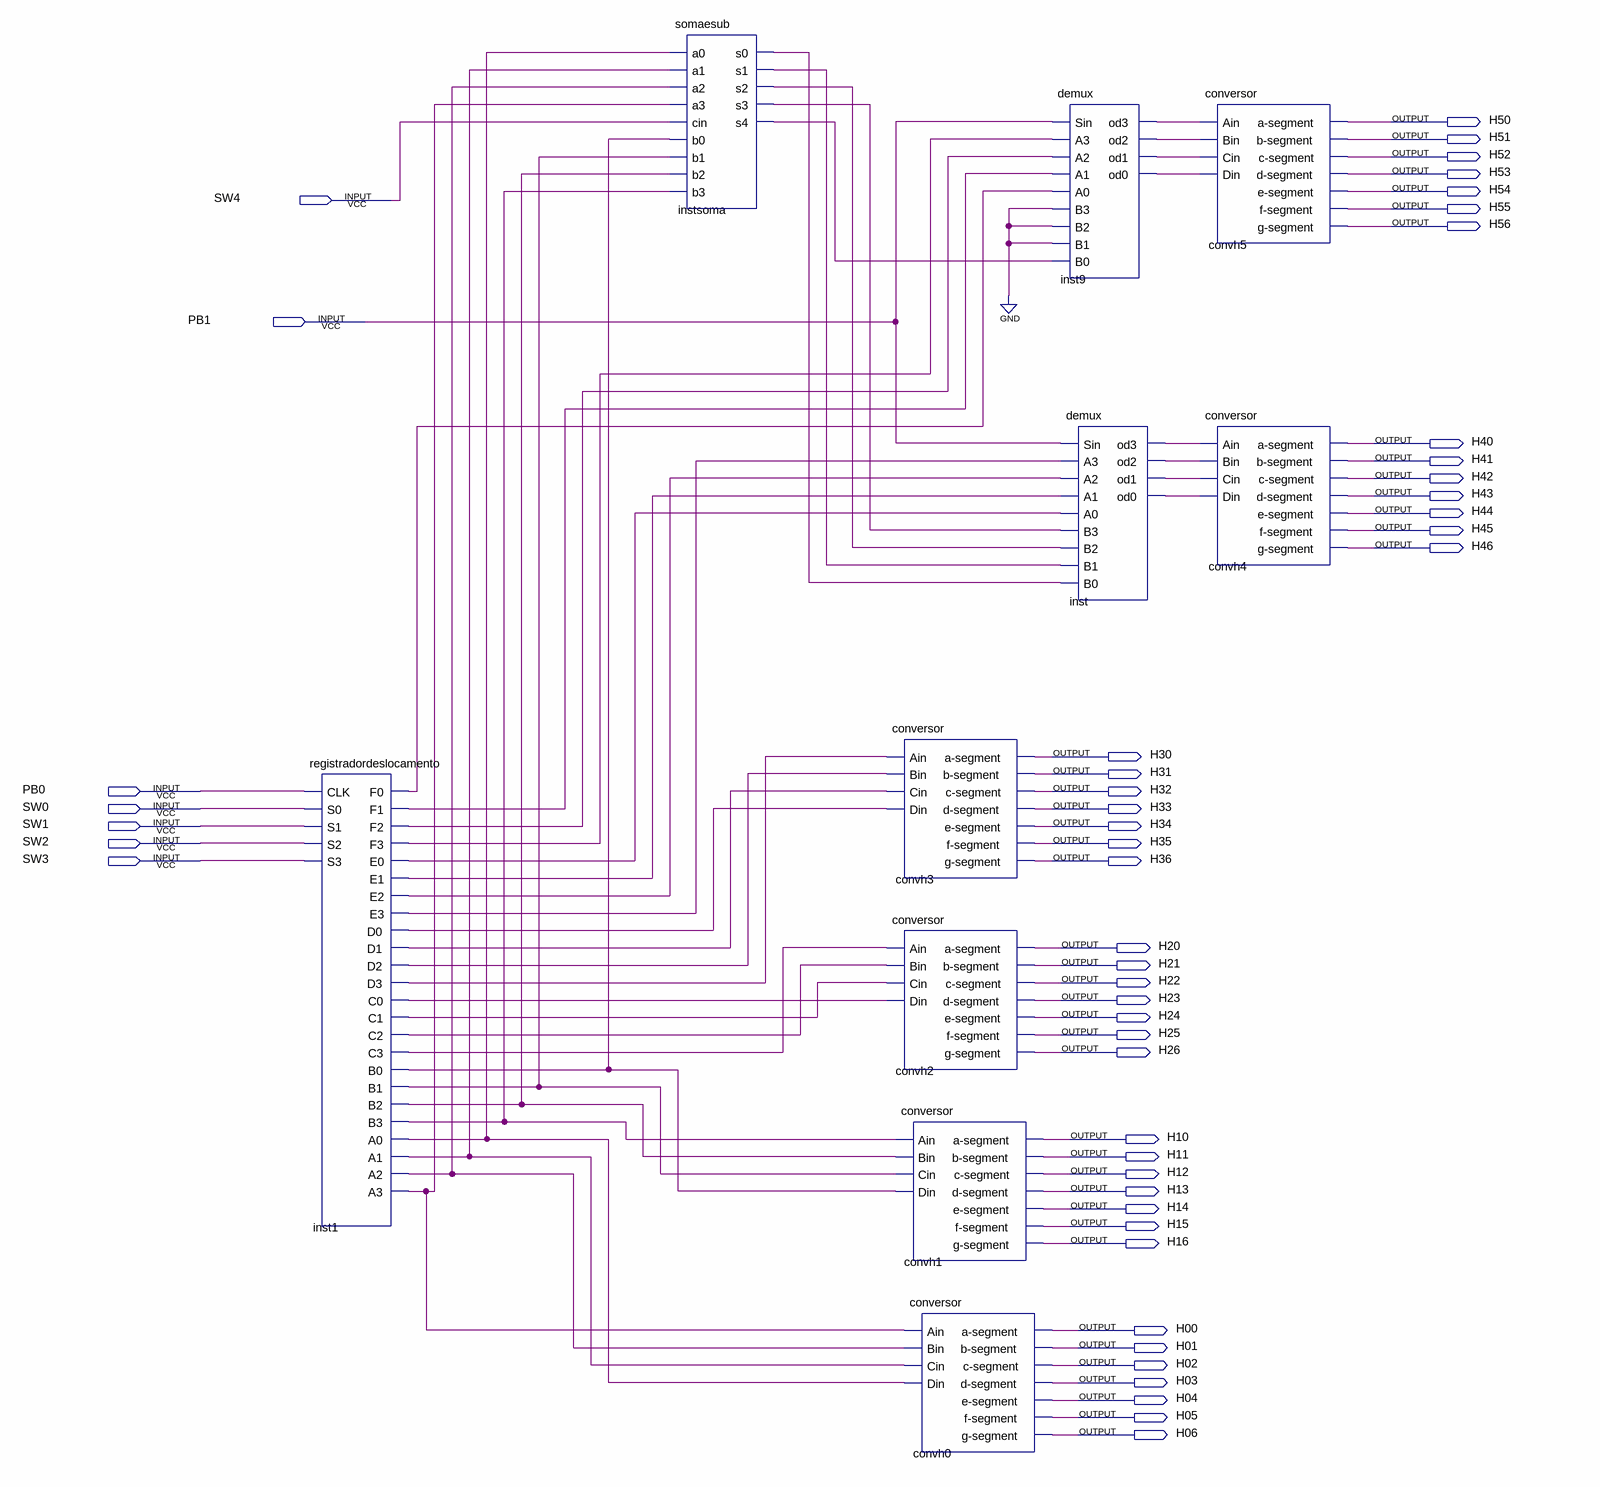
[diagram p0: schematic sheet]
// Quartus schematic contadorasync.bdf as structural Verilog: 10 symbols, 49 pins
module contadorasync (
  input  SW4,
  input  PB1,
  input  PB0,
  input  SW0,
  input  SW1,
  input  SW2,
  input  SW3,
  output H50,
  output H51,
  output H52,
  output H53,
  output H54,
  output H55,
  output H56,
  output H40,
  output H41,
  output H42,
  output H43,
  output H44,
  output H45,
  output H46,
  output H30,
  output H31,
  output H32,
  output H33,
  output H34,
  output H35,
  output H36,
  output H20,
  output H21,
  output H22,
  output H23,
  output H24,
  output H25,
  output H26,
  output H10,
  output H11,
  output H12,
  output H13,
  output H14,
  output H15,
  output H16,
  output H00,
  output H01,
  output H02,
  output H03,
  output H04,
  output H05,
  output H06
);

  wire inst1_a0, inst1_a1, inst1_a2, inst1_a3, inst1_b0, inst1_b1, inst1_b2, inst1_b3, inst1_c0, inst1_c1,
       inst1_c2, inst1_c3, inst1_d0, inst1_d1, inst1_d2, inst1_d3, inst1_e0, inst1_e1, inst1_e2, inst1_e3,
       inst1_f0, inst1_f1, inst1_f2, inst1_f3, inst9_od0, inst9_od1, inst9_od2, inst9_od3, inst_od0,
       inst_od1, inst_od2, inst_od3, instsoma_s0, instsoma_s1, instsoma_s2, instsoma_s3, instsoma_s4;

  registradordeslocamento inst1 (
    .CLK(PB0), .S0(SW0), .S1(SW1), .S2(SW2), .S3(SW3), .F0(inst1_f0), .F1(inst1_f1), .F2(inst1_f2),
    .F3(inst1_f3), .E0(inst1_e0), .E1(inst1_e1), .E2(inst1_e2), .E3(inst1_e3), .D0(inst1_d0), .D1(inst1_d1),
    .D2(inst1_d2), .D3(inst1_d3), .C0(inst1_c0), .C1(inst1_c1), .C2(inst1_c2), .C3(inst1_c3), .B0(inst1_b0),
    .B1(inst1_b1), .B2(inst1_b2), .B3(inst1_b3), .A0(inst1_a0), .A1(inst1_a1), .A2(inst1_a2), .A3(inst1_a3));
  somaesub instsoma (
    .a0(inst1_a0), .a1(inst1_a1), .a2(inst1_a2), .a3(inst1_a3), .cin(SW4), .b0(inst1_b0), .b1(inst1_b1),
    .b2(inst1_b2), .b3(inst1_b3), .s0(instsoma_s0), .s1(instsoma_s1), .s2(instsoma_s2), .s3(instsoma_s3),
    .s4(instsoma_s4));
  conversor convh3 (
    .Ain(inst1_d3), .Bin(inst1_d2), .Cin(inst1_d1), .Din(inst1_d0), .\a-segment (H30), .\b-segment (H31),
    .\c-segment (H32), .\d-segment (H33), .\e-segment (H34), .\f-segment (H35), .\g-segment (H36));
  conversor convh2 (
    .Ain(inst1_c3), .Bin(inst1_c2), .Cin(inst1_c1), .Din(inst1_c0), .\a-segment (H20), .\b-segment (H21),
    .\c-segment (H22), .\d-segment (H23), .\e-segment (H24), .\f-segment (H25), .\g-segment (H26));
  conversor convh1 (
    .Ain(inst1_b3), .Bin(inst1_b2), .Cin(inst1_b1), .Din(inst1_b0), .\a-segment (H10), .\b-segment (H11),
    .\c-segment (H12), .\d-segment (H13), .\e-segment (H14), .\f-segment (H15), .\g-segment (H16));
  conversor convh0 (
    .Ain(inst1_a3), .Bin(inst1_a2), .Cin(inst1_a1), .Din(inst1_a0), .\a-segment (H00), .\b-segment (H01),
    .\c-segment (H02), .\d-segment (H03), .\e-segment (H04), .\f-segment (H05), .\g-segment (H06));
  demux inst9 (
    .Sin(PB1), .A3(inst1_f3), .A2(inst1_f2), .A1(inst1_f1), .A0(inst1_f0), .B3(1'b0), .B2(1'b0), .B1(1'b0),
    .B0(instsoma_s4), .od3(inst9_od3), .od2(inst9_od2), .od1(inst9_od1), .od0(inst9_od0));
  demux inst (
    .Sin(PB1), .A3(inst1_e3), .A2(inst1_e2), .A1(inst1_e1), .A0(inst1_e0), .B3(instsoma_s3),
    .B2(instsoma_s2), .B1(instsoma_s1), .B0(instsoma_s0), .od3(inst_od3), .od2(inst_od2), .od1(inst_od1),
    .od0(inst_od0));
  conversor convh5 (
    .Ain(inst9_od3), .Bin(inst9_od2), .Cin(inst9_od1), .Din(inst9_od0), .\a-segment (H50), .\b-segment (H51),
    .\c-segment (H52), .\d-segment (H53), .\e-segment (H54), .\f-segment (H55), .\g-segment (H56));
  conversor convh4 (
    .Ain(inst_od3), .Bin(inst_od2), .Cin(inst_od1), .Din(inst_od0), .\a-segment (H40), .\b-segment (H41),
    .\c-segment (H42), .\d-segment (H43), .\e-segment (H44), .\f-segment (H45), .\g-segment (H46));
endmodule
